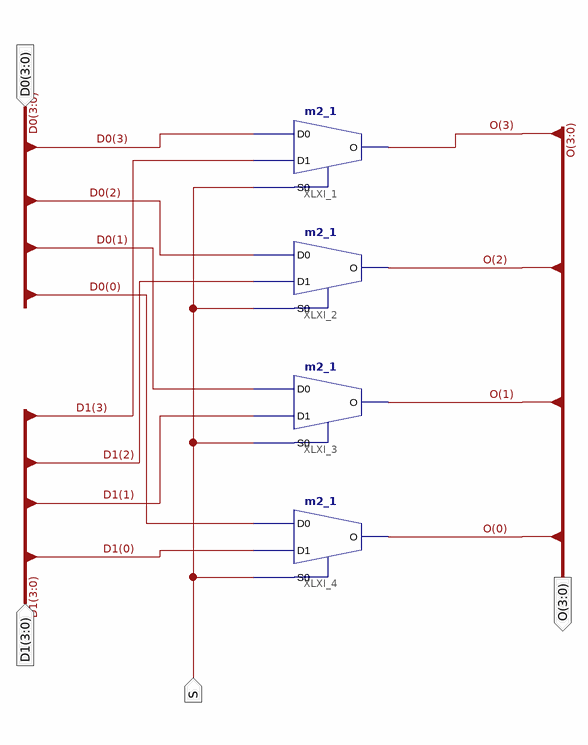
[diagram p0: schematic sheet 1]
// Xilinx ISE schematic mux4bit2to1.sch (spartan3e) as structural Verilog: 4 symbols, 4 ports
module mux4bit2to1 (
  input  [3:0] D0,
  input  [3:0] D1,
  input  S,
  output [3:0] O
);

  m2_1 XLXI_1 (.D0(D0[3]), .D1(D1[3]), .S0(S), .O(O[3]));
  m2_1 XLXI_2 (.D0(D0[2]), .D1(D1[2]), .S0(S), .O(O[2]));
  m2_1 XLXI_3 (.D0(D0[1]), .D1(D1[1]), .S0(S), .O(O[1]));
  m2_1 XLXI_4 (.D0(D0[0]), .D1(D1[0]), .S0(S), .O(O[0]));
endmodule
